# Altium schematic sheet Blueetooth.SchDoc
size A
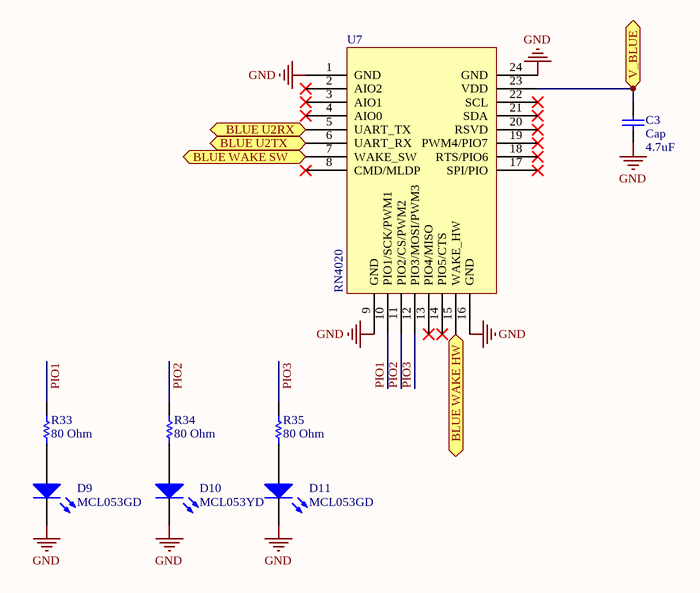
[diagram p0: Blueetooth.SchDoc]

## Parts
C3  Cap  value 4.7uF  [Capacitor]
D9  MCL053GD  [LedGreen]
D10  MCL053YD  [LedGreen]
D11  MCL053GD  [LedGreen]
R33  80 Ohm  [Resistor0603]
R34  80 Ohm  [Resistor0603]
R35  80 Ohm  [Resistor0603]
U7  RN4020  [bluetooth]

## Ports
BLUE U2RX, BLUE U2TX, BLUE WAKE HW, BLUE WAKE SW, V_BLUE

## Nets
GND: C3.1 D9.2(K) D10.2(K) D11.2(K) U7.1(GND) U7.9(GND) U7.16(GND) U7.24(GND)
BLUE U2RX: U7.5(UART_TX) ; port BLUE U2RX
BLUE U2TX: U7.6(UART_RX) ; port BLUE U2TX
BLUE WAKE HW: U7.15(WAKE_HW) ; port BLUE WAKE HW
BLUE WAKE SW: U7.7(WAKE_SW) ; port BLUE WAKE SW
PIO1: R33.2 U7.10(PIO1/SCK/PWM1)
PIO2: R34.2 U7.11(PIO2/CS/PWM2)
PIO3: R35.2 U7.12(PIO3/MOSI/PWM3)
V_BLUE: C3.2 U7.23(VDD) ; port V_BLUE
NetD9_1: D9.1(A) R33.1
NetD10_1: D10.1(A) R34.1
NetD11_1: D11.1(A) R35.1

Not connected (* = marked no-connect by the designer): U7 2(AIO2)* 3(AIO1)* 4(AIO0)* 8(CMD/MLDP)* 13(PIO4/MISO)* 14(PIO5/CTS)* 17(SPI/PIO)* 18(RTS/PIO6)* 19(PWM4/PIO7)* 20(RSVD)* 21(SDA)* 22(SCL)*

## Library data of the parts
C3 = Cap: Capacitor; Published: 8-Jun-2000; LatestRevisionDate: 17-Jul-2002; LatestRevisionNote: Re-released for DXP Platform.; PackageReference: RAD-0.3; Publisher: Altium Limited; PackageDescription: Radial Cap, Thru-Hole; 2 Leads; 0.3 in Pin Spacing
D9-D11 = LED0: Typical INFRARED GaAs LED; Published: 8-Jun-2000; LatestRevisionDate: 08-Jul-2005; LatestRevisionNote: Mech Layer 1 removed.; PackageReference: LED-0; Publisher: Altium Limited; PackageDescription: LED; 2 Leads
  D9 D11: Farnell Reference: 1581138
  D10: Farnell Reference: 1581139
R33-R35 = Res1: Resistor; Published: 8-Jun-2000; LatestRevisionDate: 17-Jul-2002; LatestRevisionNote: Re-released for DXP Platform.; PackageReference: AXIAL-0.3; Publisher: Altium Limited; PackageDescription: Axial Device, Thru-Hole; 2 Leads; 0.3 in Pin Spacing; Value: 80 Ohm
U7 = Blueetooth: Farnell Reference: 2442930